# EAGLE schematic usg-core (EAGLE 9.5.1)

## Sheet 1 of 3
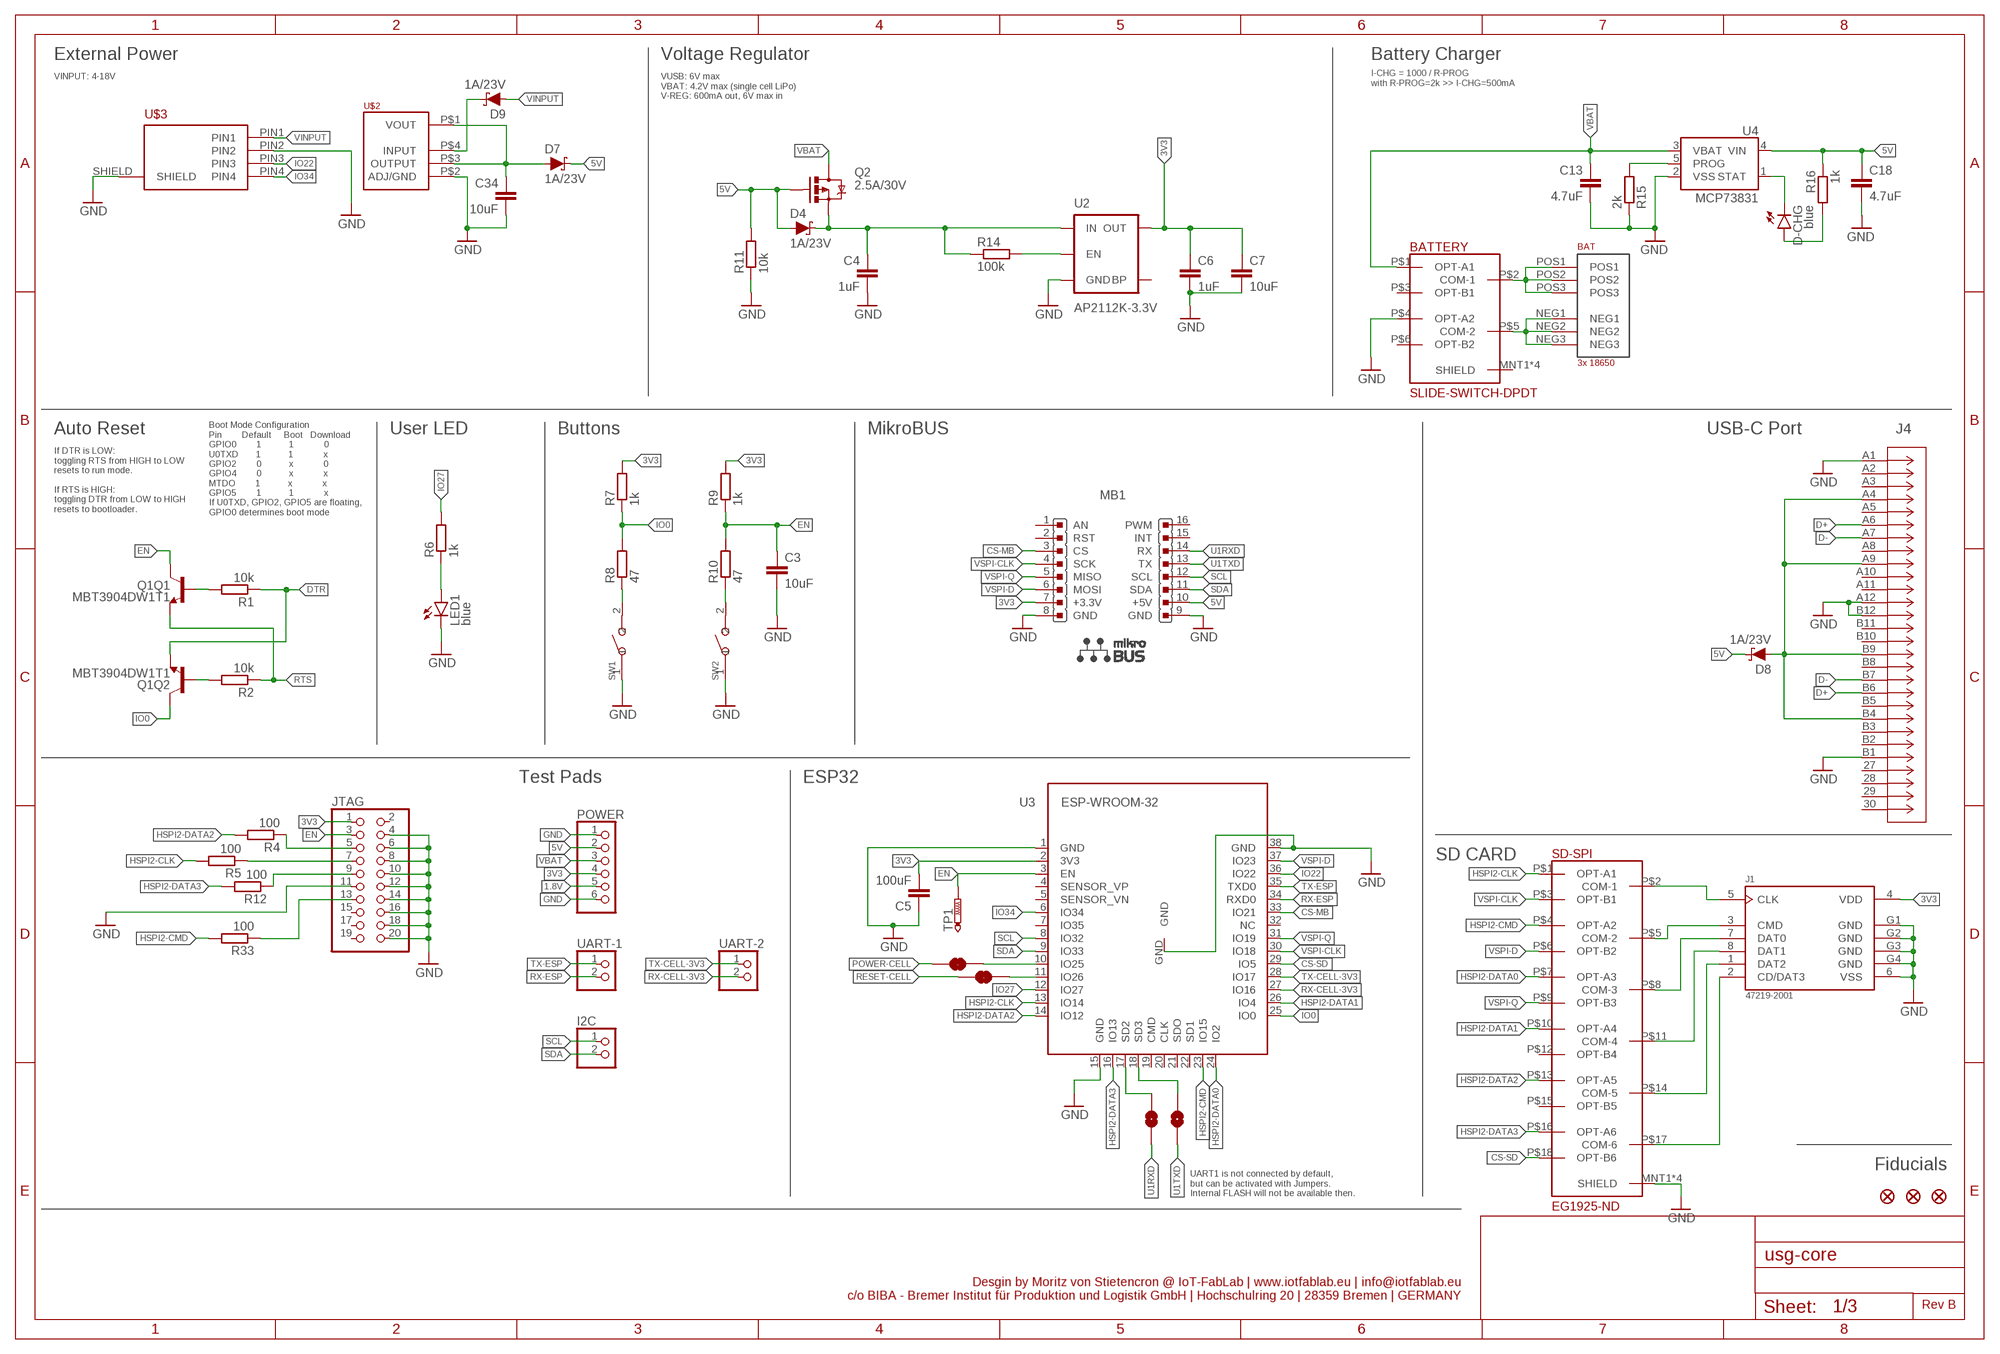
[diagram p0: schematic, sheet 1]

### Parts
BAT  3x 18650  BK-18650-PC6  [BK-18650-PC6]
BATTERY  SLIDE-SWITCH-DPDT  [SLIDE-SWITCH-DPDT]
C3  10uF  C-EUC0603  [C0603]
C4  1uF  C-EUC0603  [C0603]
C5  100uF  C-EUC1206  [C1206]
C6  1uF  C-EUC0603  [C0603]
C7  10uF  C-EUC0603  [C0603]
C13  4.7uF  C-EUC0603  [C0603]
C18  4.7uF  C-EUC0603  [C0603]
C34  10uF  C-EUC0603  [C0603]
D4  1A/23V  DIODE-SCHOTTKY-BAT20J  [SOD-323]
D7  1A/23V  DIODE-SCHOTTKY-BAT20J  [SOD-323]
D8  1A/23V  DIODE-SCHOTTKY-BAT20J  [SOD-323]
D9  1A/23V  DIODE-SCHOTTKY-BAT20J  [SOD-323]
D-CHG  blue  LEDCHIP-LED0603  [CHIP-LED0603]
FD1  FIDUCIAL1X2  [FIDUCIAL-1X2]
FD2  FIDUCIAL1X2  [FIDUCIAL-1X2]
FD3  FIDUCIAL1X2  [FIDUCIAL-1X2]
I2C  PINHD-1X2  [1X02]
J1  47219-2001  [MOLEX_47219-2001]
J4  DX07S024WJ3R400  [CONN_DX07S024WJ3R400]
JP10  JUMPER-SMT_2_NC_TRACE_SILK  [SMT-JUMPER_2_NC_TRACE_SILK]
JP11  JUMPER-SMT_2_NC_TRACE_SILK  [SMT-JUMPER_2_NC_TRACE_SILK]
JTAG  PINHD-2X10  [2X10]
LED1  blue  LEDCHIP-LED0603  [CHIP-LED0603]
MB1  MIKROBUS  [MIKROBUS]
POWER  PINHD-1X6  [1X06]
Q1  MBT3904DW1T1  TRANS_NPN_DUAL-MBT3904DW1T1  [SC70-6]
Q2  2.5A/30V  MOSFET-PCHANNELDMG2307L  [SOT23-3@1]
R1  10k  R-EU_R0603  [R0603]
R2  10k  R-EU_R0603  [R0603]
R4  100  R-EU_R0603  [R0603]
R5  100  R-EU_R0603  [R0603]
R6  1k  R-EU_R0603  [R0603]
R7  1k  R-EU_R0603  [R0603]
R8  47  R-EU_R0603  [R0603]
R9  1k  R-EU_R0603  [R0603]
R10  47  R-EU_R0603  [R0603]
R11  10k  R-EU_R0603  [R0603]
R12  100  R-EU_R0603  [R0603]
R14  100k  R-EU_R0603  [R0603]
R15  2k  R-EU_R0603  [R0603]
R16  1k  R-EU_R0603  [R0603]
R33  100  R-EU_R0603  [R0603]
SD-SPI  EG1925-ND  SLIDE-SWITCH-6PDT  [SLIDE-SWITCH-6PDT]
SJ1  JUMPER-SMT_2_NO_SILK  [SMT-JUMPER_2_NO_SILK]
SJ2  JUMPER-SMT_2_NO_SILK  [SMT-JUMPER_2_NO_SILK]
SW1  SMD-BUTTON(2P-3.0X2.5X1.2+0.4MM)-B3U-1000P-2P-SMD  [SW2-2.6-3.0X2.5X1.2+0.4MM]
SW2  SMD-BUTTON(2P-3.0X2.5X1.2+0.4MM)-B3U-1000P-2P-SMD  [SW2-2.6-3.0X2.5X1.2+0.4MM]
TP1  PTR1B1,27  [B1,27]
U2  AP2112K-3.3V  V_REG_LDOSMD  [SOT23-5]
U3  ESP-WROOM-32  [ESP-WROOM-32]
U4  MCP73831  [SOT23-5]
U$2  LDO-AZ1117I  [SOT223]
U$3  SACC-CI-M12FSD-4CON-L90  [SACC-CI-M12FSD-4CON-L90]
UART-1  PINHD-1X2  [1X02]
UART-2  PINHD-1X2  [1X02]

### Nets
1.8V: POWER.5 ; also sheet 2
3V3 [3.3V]: C5.2 C6.1 C7.1 J1.4(VDD) JTAG.1 MB1.7(+3.3V) POWER.4 R7.2 R9.2 U2.5(OUT) U3.2(3V3) ; also sheet 2,3
5V [3.3V]: C18.1 D4.A D7.C D8.C MB1.10(+5V) POWER.2 Q2.1(G) R11.2 R16.1 U4.4(VIN) ; also sheet 3
BTN1: R10.1 SW2.2
CHG: D-CHG.C U4.1(STAT)
CS-MB: MB1.3(CS) U3.33(IO21)
CS-SD: SD-SPI.P$18(OPT-B6) U3.29(IO5)
D+: J4.A6 J4.B6 ; also sheet 3
D-: J4.A7 J4.B7 ; also sheet 3
DTR: Q1.1(Q2:E) R1.1 ; also sheet 3
EN: C3.1 JTAG.3 Q1.3(Q1:C) R9.1 R10.2 TP1.TP U3.3(EN)
EN1: R14.2 U2.3(EN)
GND [USB_Data]: BATTERY.P$4(OPT-A2) C3.2 C4.2 C5.1 C6.2 C7.2 C13.2 C18.2 C34.2 J1.6(VSS) J1.G1(GND) J1.G2(GND) J1.G3(GND) J1.G4(GND) J4.A1 J4.A12 J4.B1 J4.B12 JTAG.4 JTAG.6 JTAG.8 JTAG.10 JTAG.11 JTAG.12 JTAG.14 JTAG.16 JTAG.18 JTAG.20 LED1.C MB1.8(GND) MB1.9(GND) POWER.1 POWER.6 R11.1 R15.1 SD-SPI.MNT1(SHIELD) SD-SPI.MNT2(SHIELD) SD-SPI.MNT3(SHIELD) SD-SPI.MNT4(SHIELD) SW1.1 SW2.1 U2.2(GND) U3.1(GND) U3.15(GND) U3.38(GND) U3.GND U4.2(VSS) U$2.P$2(ADJ/GND) U$3.PIN2 U$3.SHIELD ; also sheet 2,3
HSPI2-CLK: R5.2 SD-SPI.P$1(OPT-A1) U3.13(IO14)
HSPI2-CMD: R33.2 SD-SPI.P$4(OPT-A2) U3.23(IO15)
HSPI2-DATA0: SD-SPI.P$7(OPT-A3) U3.24(IO2)
HSPI2-DATA1: SD-SPI.P$10(OPT-A4) U3.26(IO4)
HSPI2-DATA2: R4.2 SD-SPI.P$13(OPT-A5) U3.14(IO12)
HSPI2-DATA3: R12.2 SD-SPI.P$16(OPT-A6) U3.16(IO13)
IO0: Q1.6(Q2:C) R7.1 R8.2 U3.25(IO0)
IO22: U3.36(IO22) U$3.PIN3
IO27: R6.2 U3.12(IO27)
IO34: U3.6(IO34) U$3.PIN4
N$1: D9.C U$2.P$4(INPUT)
N$4: D-CHG.A R16.2
N$5: R15.2 U4.5(PROG)
N$6: Q1.5(Q1:B) R1.2
N$7: LED1.A R6.1
N$21: R8.1 SW1.2
N$22: Q1.2(Q2:B) R2.2
N$27: D8.A J4.A4 J4.A9 J4.B4 J4.B9
N$28: JP10.2 U3.10(IO25)
N$29: JP11.2 U3.11(IO26)
N$42: SJ1.2 U3.17(SD2)
N$43: SJ2.2 U3.18(SD3)
N$44: J1.5(CLK) SD-SPI.P$2(COM-1)
N$45: J1.3(CMD) SD-SPI.P$5(COM-2)
N$46: J1.2(CD/DAT3) SD-SPI.P$17(COM-6)
N$47: J1.1(DAT2) SD-SPI.P$14(COM-5)
N$48: J1.8(DAT1) SD-SPI.P$11(COM-4)
N$49: J1.7(DAT0) SD-SPI.P$8(COM-3)
N$51: JTAG.5 R4.1
N$56: JTAG.7 R5.1
N$57: JTAG.9 R12.1
N$58: JTAG.13 R33.1
N$59 [3.3V]: BAT.POS1 BAT.POS2 BAT.POS3 BATTERY.P$2(COM-1)
N$60 [USB_Data]: BAT.NEG1 BAT.NEG2 BAT.NEG3 BATTERY.P$5(COM-2)
POWER-CELL: JP10.1 ; also sheet 2
RESET-CELL: JP11.1 ; also sheet 2
RTS: Q1.4(Q1:E) R2.1 ; also sheet 3
RX-CELL-3V3: U3.27(IO16) UART-2.2 ; also sheet 2
RX-ESP: U3.34(RXD0) UART-1.2 ; also sheet 3
SCL: I2C.1 MB1.12(SCL) U3.8(IO32) ; also sheet 2,3
SDA: I2C.2 MB1.11(SDA) U3.9(IO33) ; also sheet 2,3
TX-CELL-3V3: U3.28(IO17) UART-2.1 ; also sheet 2
TX-ESP: U3.35(TXD0) UART-1.1 ; also sheet 3
U1RXD: MB1.14(RX) SJ1.1
U1TXD: MB1.13(TX) SJ2.1
VBAT [3.3V]: BATTERY.P$1(OPT-A1) C13.1 POWER.3 Q2.3(D) U4.3(VBAT)
VIN [3.3V]: C4.1 D4.C Q2.2(S) R14.1 U2.1(IN)
VINPUT [3.3V]: D9.A U$3.PIN1
VOUT [3.3V]: C34.1 D7.A U$2.P$1(VOUT) U$2.P$3(OUTPUT)
VSPI-CLK: MB1.4(SCK) SD-SPI.P$3(OPT-B1) U3.30(IO18)
VSPI-D: MB1.6(MOSI) SD-SPI.P$6(OPT-B2) U3.37(IO23)
VSPI-Q: MB1.5(MISO) SD-SPI.P$9(OPT-B3) U3.31(IO19)
Unconnected: BATTERY.MNT1(SHIELD) BATTERY.MNT2(SHIELD) BATTERY.MNT3(SHIELD) BATTERY.MNT4(SHIELD) BATTERY.P$3(OPT-B1) BATTERY.P$6(OPT-B2) J4.27 J4.28 J4.29 J4.30 J4.A2 J4.A3 J4.A5 J4.A8 J4.A10 J4.A11 J4.B2 J4.B3 J4.B5 J4.B8 J4.B10 J4.B11 JTAG.2 JTAG.15 JTAG.17 JTAG.19 MB1.1(AN) MB1.2(RST) MB1.15(INT) MB1.16(PWM) SD-SPI.P$12(OPT-B4) SD-SPI.P$15(OPT-B5) U2.4(BP) U3.4(SENSOR_VP) U3.5(SENSOR_VN) U3.7(IO35) U3.19(CMD) U3.20(CLK) U3.21(SDO) U3.22(SD1) U3.32(NC)

### Notes on the sheet
- External Power | Voltage Regulator | Battery Charger
- VINPUT: 4-18V
- VUSB: 6V max
  VBAT: 4.2V max (single cell LiPo)
  V-REG: 600mA out, 6V max in
- I-CHG = 1000 / R-PROG
  with R-PROG=2k >> I-CHG=500mA
- Boot Mode Configuration
  Pin        Default     Boot   Download
  GPIO0        1           1            0
  U0TXD       1           1            x
  GPIO2        0           x            0
  GPIO4        0           x            x
  MTDO        1           x            x
  GPIO5        1           1            x
  If U0TXD, GPIO2, GPIO5 are floating, 
  GPIO0 determines boot mode
- Auto Reset | User LED | Buttons | MikroBUS | USB-C Port
- If DTR is LOW:
  toggling RTS from HIGH to LOW 
  resets to run mode.
  
  If RTS is HIGH:
  toggling DTR from LOW to HIGH
  resets to bootloader.
- Test Pads | ESP32
- SD CARD
- UART1 is not connected by default, 
  but can be activated with Jumpers. 
  Internal FLASH will not be available then.
- Fiducials
- Desgin by Moritz von Stietencron @ IoT-FabLab | www.iotfablab.eu | info@iotfablab.eu
  c/o BIBA - Bremer Institut für Produktion und Logistik GmbH | Hochschulring 20 | 28359 Bremen | GERMANY
- Rev B

## Sheet 2 of 3
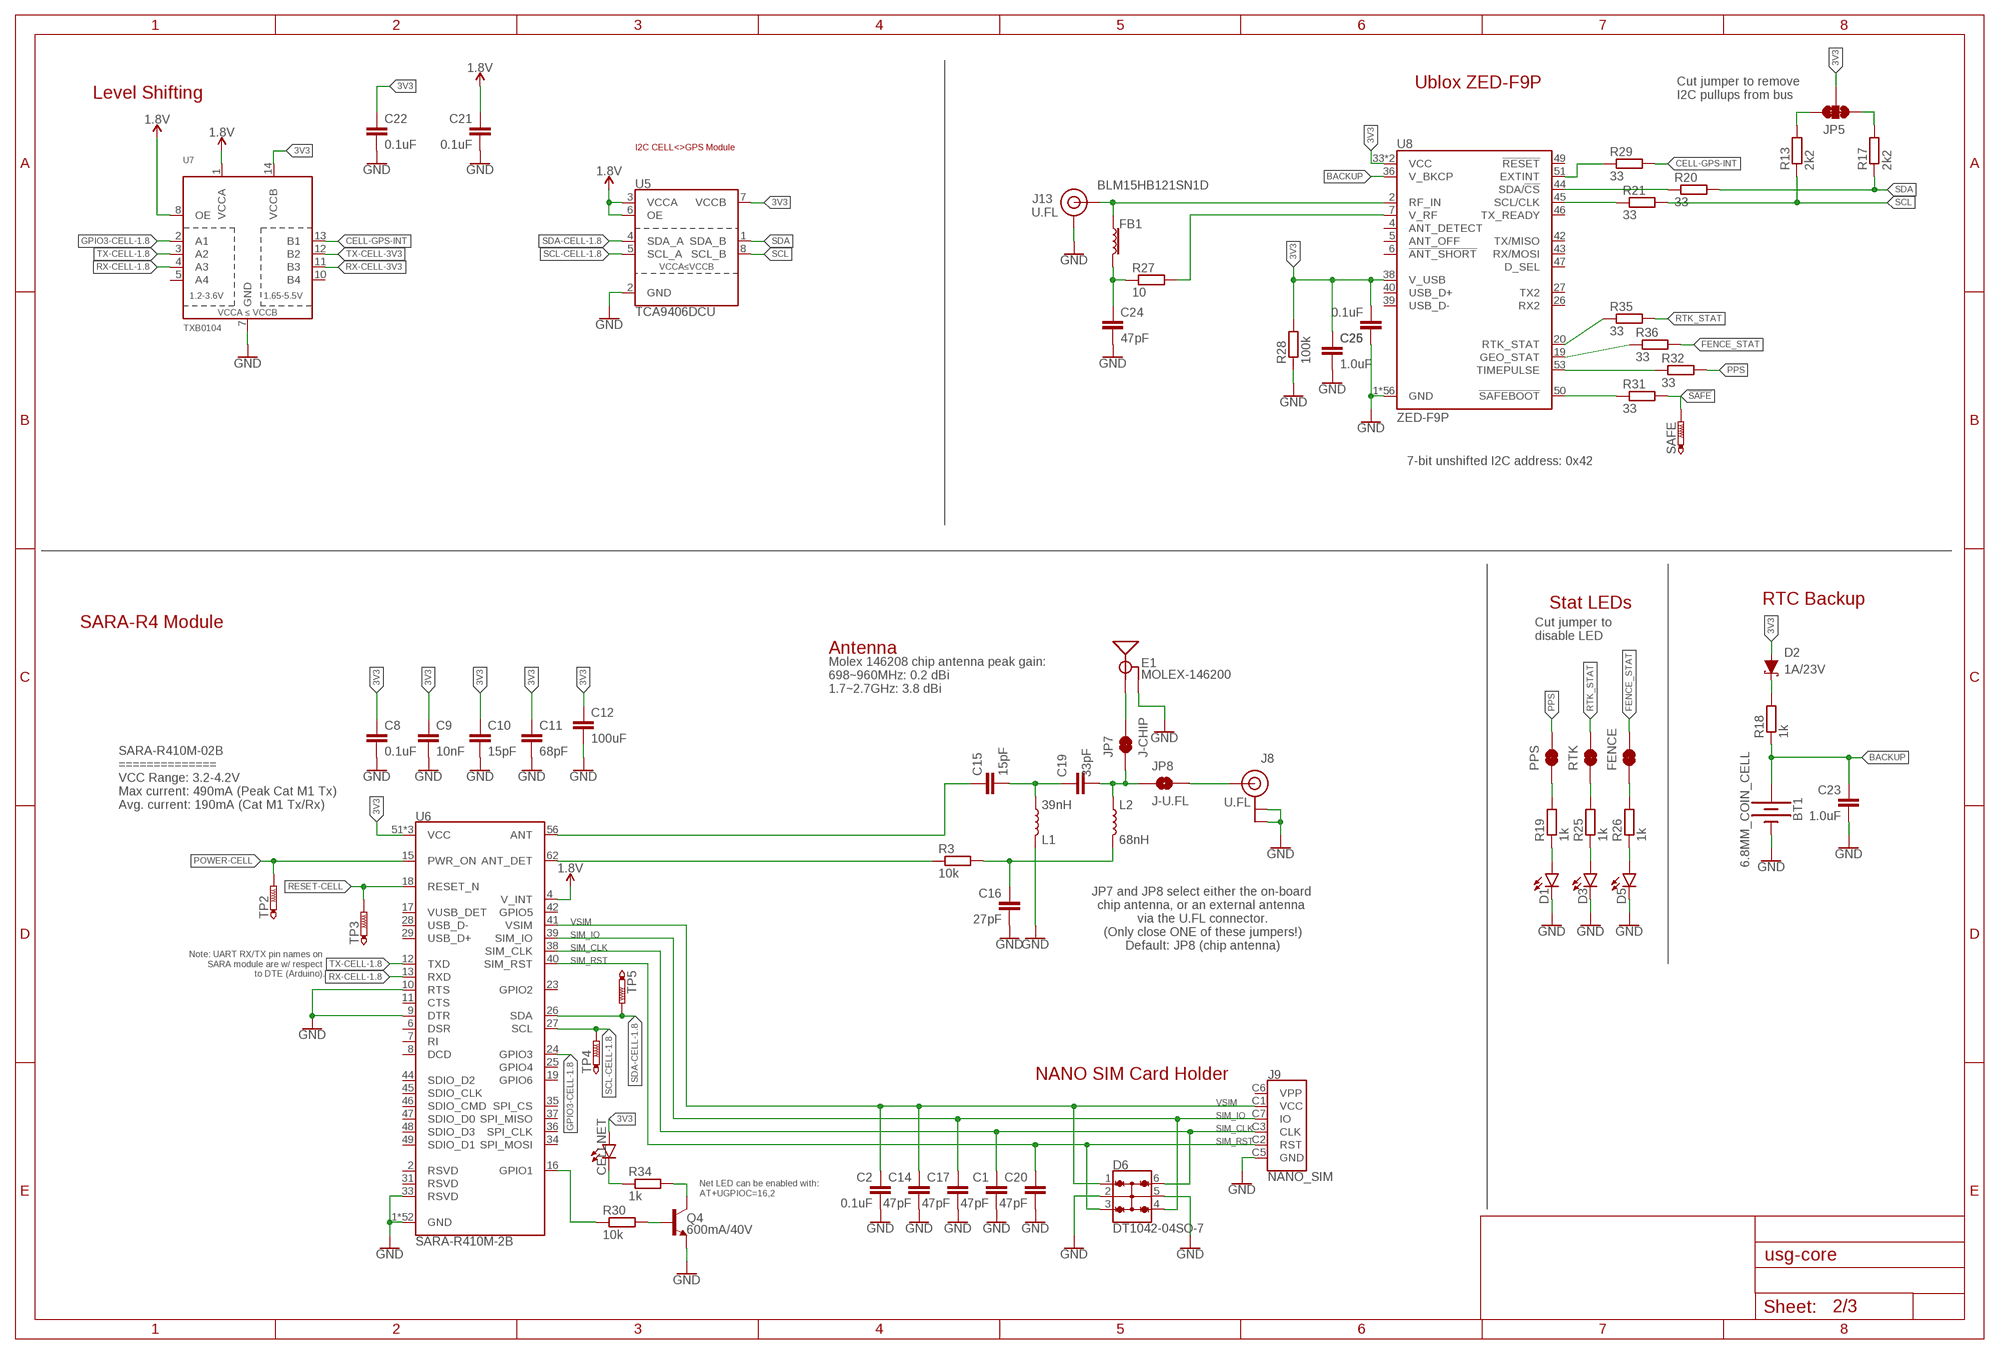
[diagram p1: schematic, sheet 2]

### Parts
BT1  6.8MM_COIN_CELL  BATTERY-6.8MM_SMD  [BATTCON-6.8MM]
C1  47pF  C-EUC0603  [C0603]
C2  0.1uF  C-EUC0603  [C0603]
C8  0.1uF  C-EUC0603  [C0603]
C9  10nF  C-EUC0603  [C0603]
C10  15pF  C-EUC0603  [C0603]
C11  68pF  C-EUC0603  [C0603]
C12  100uF  C-EUC1206  [C1206]
C14  47pF  C-EUC0603  [C0603]
C15  15pF  C-EUC0603  [C0603]
C16  27pF  C-EUC0603  [C0603]
C17  47pF  C-EUC0603  [C0603]
C19  33pF  C-EUC0603  [C0603]
C20  47pF  C-EUC0603  [C0603]
C21  0.1uF  C-EUC0603  [C0603]
C22  0.1uF  C-EUC0603  [C0603]
C23  1.0uF  C-EUC0603  [C0603]
C24  47pF  C-EUC0603  [C0603]
C25  1.0uF  C-EUC0603  [C0603]
C26  0.1uF  C-EUC0603  [C0603]
CELLNET  blue  LEDCHIP-LED0603  [CHIP-LED0603]
D1  blue  LEDCHIP-LED0603  [CHIP-LED0603]
D2  1A/23V  DIODE-SCHOTTKY-BAT20J  [SOD-323]
D3  blue  LEDCHIP-LED0603  [CHIP-LED0603]
D5  blue  LEDCHIP-LED0603  [CHIP-LED0603]
D6  DT1042-04SO-7  TVS_DIODE_ARRAY_4DT1042-04SO-7  [SOT23-6L]
E1  MOLEX-146200  ANTENNA-GROUNDEDMOLEX-146200  [MOLEX_146200]
FB1  FERRITE_BEAD-120_OHM-0402  [0402]
FENCE  JUMPER-SMT_2_NC_TRACE_SILK  [SMT-JUMPER_2_NC_TRACE_SILK]
J8  U.FL  [U.FL]
J9  NANO_SIM  NANO_SIMWURTH  [NANO_SIM_WURTH_693043020611]
J13  U.FL  U.FL2PIN  [U.FL]
JP5  JUMPER-SMT_3_2-NC_TRACE_SILK  [SMT-JUMPER_3_2-NC_TRACE_SILK]
JP7  J-CHIP  JUMPER-SMT_2_NC_TRACE_NO-SILK  [SMT-JUMPER_2_NC_TRACE_NO-SILK]
JP8  J-U.FL  JUMPER-SMT_2_NO_NO-SILK  [SMT-JUMPER_2_NO_NO-SILK]
L1  39nH  INDUCTOR-0603-39NH  [0603]
L2  68nH  INDUCTOR-0603-68NH  [0603]
PPS  JUMPER-SMT_2_NC_TRACE_SILK  [SMT-JUMPER_2_NC_TRACE_SILK]
Q4  600mA/40V  TRANS_NPN-MMBT2222AL  [SOT23-3]
R3  10k  R-EU_R0603  [R0603]
R13  2k2  R-EU_R0603  [R0603]
R17  2k2  R-EU_R0603  [R0603]
R18  1k  R-EU_R0603  [R0603]
R19  1k  R-EU_R0603  [R0603]
R20  33  R-EU_R0603  [R0603]
R21  33  R-EU_R0603  [R0603]
R25  1k  R-EU_R0603  [R0603]
R26  1k  R-EU_R0603  [R0603]
R27  10  R-EU_R0603  [R0603]
R28  100k  R-EU_R0603  [R0603]
R29  33  R-EU_R0603  [R0603]
R30  10k  R-EU_R0603  [R0603]
R31  33  R-EU_R0603  [R0603]
R32  33  R-EU_R0603  [R0603]
R34  1k  R-EU_R0603  [R0603]
R35  33  R-EU_R0603  [R0603]
R36  33  R-EU_R0603  [R0603]
RTK  JUMPER-SMT_2_NC_TRACE_SILK  [SMT-JUMPER_2_NC_TRACE_SILK]
SAFE  PTR1B1,27  [B1,27]
TP2  PTR1B1,27  [B1,27]
TP3  PTR1B1,27  [B1,27]
TP4  PTR1B1,27  [B1,27]
TP5  PTR1B1,27  [B1,27]
U5  TCA9406DCU  [VSSOP-8]
U6  SARA-R410M-2B  SARA-R4  [SARA-LGA]
U7  TXB0104  TXB0104PWR  [TSSOP14]
U8  ZED-F9P  [ZED-F9P]

### Nets
1.8V: C21.1 U5.3(VCCA) U5.6(OE) U6.4(V_INT) U7.1(VCCA) U7.8(OE) ; also sheet 1
3V3 [3.3V]: C8.1 C9.1 C10.1 C11.1 C12.1 C22.1 C25.1 C26.2 CELLNET.A D2.A JP5.2 R28.2 U5.7(VCCB) U6.51(VCC) U6.52(VCC) U6.53(VCC) U7.14(VCCB) U8.33(VCC) U8.34(VCC) U8.38(V_USB) ; also sheet 1,3
!SAFE: R31.2 SAFE.TP
ANT: C15.1 U6.56(ANT)
ANT_DET: R3.1 U6.62(ANT_DET)
ANT_VCC: C24.1 FB1.2 R27.1
BACKUP: BT1.+ C23.1 R18.1 U8.36(V_BKCP)
CELL-GPS-INT: R29.2 U7.13(B1)
FENCE_STAT: FENCE.2 R36.2
GND [USB_Data]: BT1.- C1.2 C2.2 C8.2 C9.2 C10.2 C11.2 C12.2 C14.2 C16.2 C17.2 C20.2 C21.2 C22.2 C23.2 C24.2 C25.2 C26.1 D1.C D3.C D5.C D6.2 D6.5 E1.GND J8.1(GND) J8.2(GND) J9.C5(GND) J13.1(GND) J13.2(GND) L1.1 Q4.2(E) R28.1 U5.2(GND) U6.1(GND) U6.3(GND) U6.5(GND) U6.9(DTR) U6.10(RTS) U6.14(GND) U6.20(GND) U6.21(GND) U6.22(GND) U6.30(GND) U6.32(GND) U6.33(RSVD) U6.43(GND) U6.50(GND) U6.54(GND) U6.55(GND) U6.57(GND) U6.58(GND) U6.59(GND) U6.60(GND) U6.61(GND) U6.63(GND) U6.64(GND) U6.65(GND) U6.66(GND) U6.67(GND) U6.68(GND) U6.69(GND) U6.70(GND) U6.71(GND) U6.72(GND) U6.73(GND) U6.74(GND) U6.75(GND) U6.76(GND) U6.77(GND) U6.78(GND) U6.79(GND) U6.80(GND) U6.81(GND) U6.82(GND) U6.83(GND) U6.84(GND) U6.85(GND) U6.86(GND) U6.87(GND) U6.88(GND) U6.89(GND) U6.90(GND) U6.91(GND) U6.92(GND) U6.93(GND) U6.94(GND) U6.95(GND) U6.96(GND) U7.7(GND) U8.1(GND) U8.3(GND) U8.12(GND) U8.14(GND) U8.32(GND) U8.37(GND) U8.41(GND) U8.48(GND) U8.55(GND) U8.56(GND) U8.57(GND) U8.58(GND) U8.59(GND) U8.60(GND) U8.61(GND) U8.62(GND) U8.63(GND) U8.64(GND) U8.65(GND) U8.66(GND) U8.67(GND) U8.68(GND) U8.69(GND) U8.70(GND) U8.71(GND) U8.72(GND) U8.73(GND) U8.74(GND) U8.75(GND) U8.76(GND) U8.77(GND) U8.78(GND) U8.79(GND) U8.80(GND) U8.81(GND) U8.82(GND) U8.83(GND) U8.84(GND) U8.85(GND) U8.86(GND) U8.87(GND) U8.88(GND) U8.89(GND) U8.90(GND) U8.91(GND) U8.92(GND) U8.93(GND) U8.94(GND) U8.95(GND) U8.96(GND) U8.97(GND) U8.98(GND) U8.99(GND) U8.100(GND) U8.101(GND) U8.102(GND) ; also sheet 1,3
GPIO3-CELL-1.8: U6.24(GPIO3) U7.2(A1)
GPS_ANT1: FB1.1 J13.FEED(SIGNAL) U8.2(RF_IN)
N$2: C16.1 L2.2 R3.2
N$3: C19.2 JP7.1 JP8.1 L2.1
N$8: C15.2 C19.1 L1.2
N$9: J8.FEED(SIGNAL) JP8.2
N$10: E1.FEED(SIGNAL) JP7.2
N$12: JP5.1 R17.2
N$13: JP5.3 R13.2
N$14: D1.A R19.1
N$15: PPS.1 R19.2
N$16: D2.C R18.2
N$20: D3.A R25.1
N$23: R25.2 RTK.1
N$24: D5.A R26.1
N$25: FENCE.1 R26.2
N$26: R27.2 U8.7(V_RF)
N$30: R32.1 U8.53(TIMEPULSE)
N$31: R31.1 U8.50(!SAFEBOOT!)
N$32: R35.1 U8.20(RTK_STAT)
N$33: R36.1 U8.19(GEO_STAT)
N$41: R29.1 U8.51(EXTINT)
N$50: Q4.3(C) R34.2
N$52: Q4.1(B) R30.2
N$53: R30.1 U6.16(GPIO1)
N$55: CELLNET.C R34.1
POWER-CELL: TP2.TP U6.15(PWR_ON) ; also sheet 1
PPS: PPS.2 R32.2
RESET-CELL: TP3.TP U6.18(RESET_N) ; also sheet 1
RTK_STAT: R35.2 RTK.2
RX-CELL-1.8: U6.13(RXD) U7.4(A3)
RX-CELL-3V3: U7.11(B3) ; also sheet 1
SCL: R13.1 R21.2 U5.8(SCL_B) ; also sheet 1,3
SCL-CELL-1.8: TP4.TP U5.5(SCL_A) U6.27(SCL)
SCL_LV: R21.1 U8.45(SCL/CLK)
SDA: R17.1 R20.2 U5.1(SDA_B) ; also sheet 1,3
SDA-CELL-1.8: TP5.TP U5.4(SDA_A) U6.26(SDA)
SDA_LV: R20.1 U8.44(SDA/!CS!)
SIM_CLK: C1.1 D6.6 J9.C3(CLK) U6.38(SIM_CLK)
SIM_IO: C17.1 D6.4 J9.C7(IO) U6.39(SIM_IO)
SIM_RST: C20.1 D6.3 J9.C2(RST) U6.40(SIM_RST)
TX-CELL-1.8: U6.12(TXD) U7.3(A2)
TX-CELL-3V3: U7.12(B2) ; also sheet 1
VSIM: C2.1 C14.1 D6.1 J9.C1(VCC) U6.41(VSIM)
Unconnected: J9.C6(VPP) U6.2(RSVD) U6.6(DSR) U6.7(RI) U6.8(DCD) U6.11(CTS) U6.17(VUSB_DET) U6.19(GPIO6) U6.23(GPIO2) U6.25(GPIO4) U6.28(USB_D-) U6.29(USB_D+) U6.31(RSVD) U6.34(SPI_MOSI) U6.35(SPI_CS) U6.36(SPI_CLK) U6.37(SPI_MISO) U6.42(GPIO5) U6.44(SDIO_D2) U6.45(SDIO_CLK) U6.46(SDIO_CMD) U6.47(SDIO_D0) U6.48(SDIO_D3) U6.49(SDIO_D1) U7.5(A4) U7.10(B4) U8.4(ANT_DETECT) U8.5(ANT_OFF) U8.6(!ANT_SHORT!) U8.26(RX2) U8.27(TX2) U8.39(USB_D-) U8.40(USB_D+) U8.42(TX/MISO) U8.43(RX/MOSI) U8.46(TX_READY) U8.47(D_SEL) U8.49(!RESET!)

### Notes on the sheet
- Ublox ZED-F9P
- Level Shifting
- Cut jumper to remove 
  I2C pullups from bus
- I2C CELL<>GPS Module
- BLM15HB121SN1D
- 7-bit unshifted I2C address: 0x42
- Stat LEDs | RTC Backup
- SARA-R4 Module
- Cut jumper to 
  disable LED
- Antenna
- Molex 146208 chip antenna peak gain: 
  698~960MHz: 0.2 dBi
  1.7~2.7GHz: 3.8 dBi
- SARA-R410M-02B
  ==============
  VCC Range: 3.2-4.2V
  Max current: 490mA (Peak Cat M1 Tx)
  Avg. current: 190mA (Cat M1 Tx/Rx)
- JP7 and JP8 select either the on-board 
  chip antenna, or an external antenna 
  via the U.FL connector.
  (Only close ONE of these jumpers!)
  Default: JP8 (chip antenna)
- Note: UART RX/TX pin names on 
  SARA module are w/ respect 
  to DTE (Arduino).
- NANO SIM Card Holder
- Net LED can be enabled with:
  AT+UGPIOC=16,2

## Sheet 3 of 3
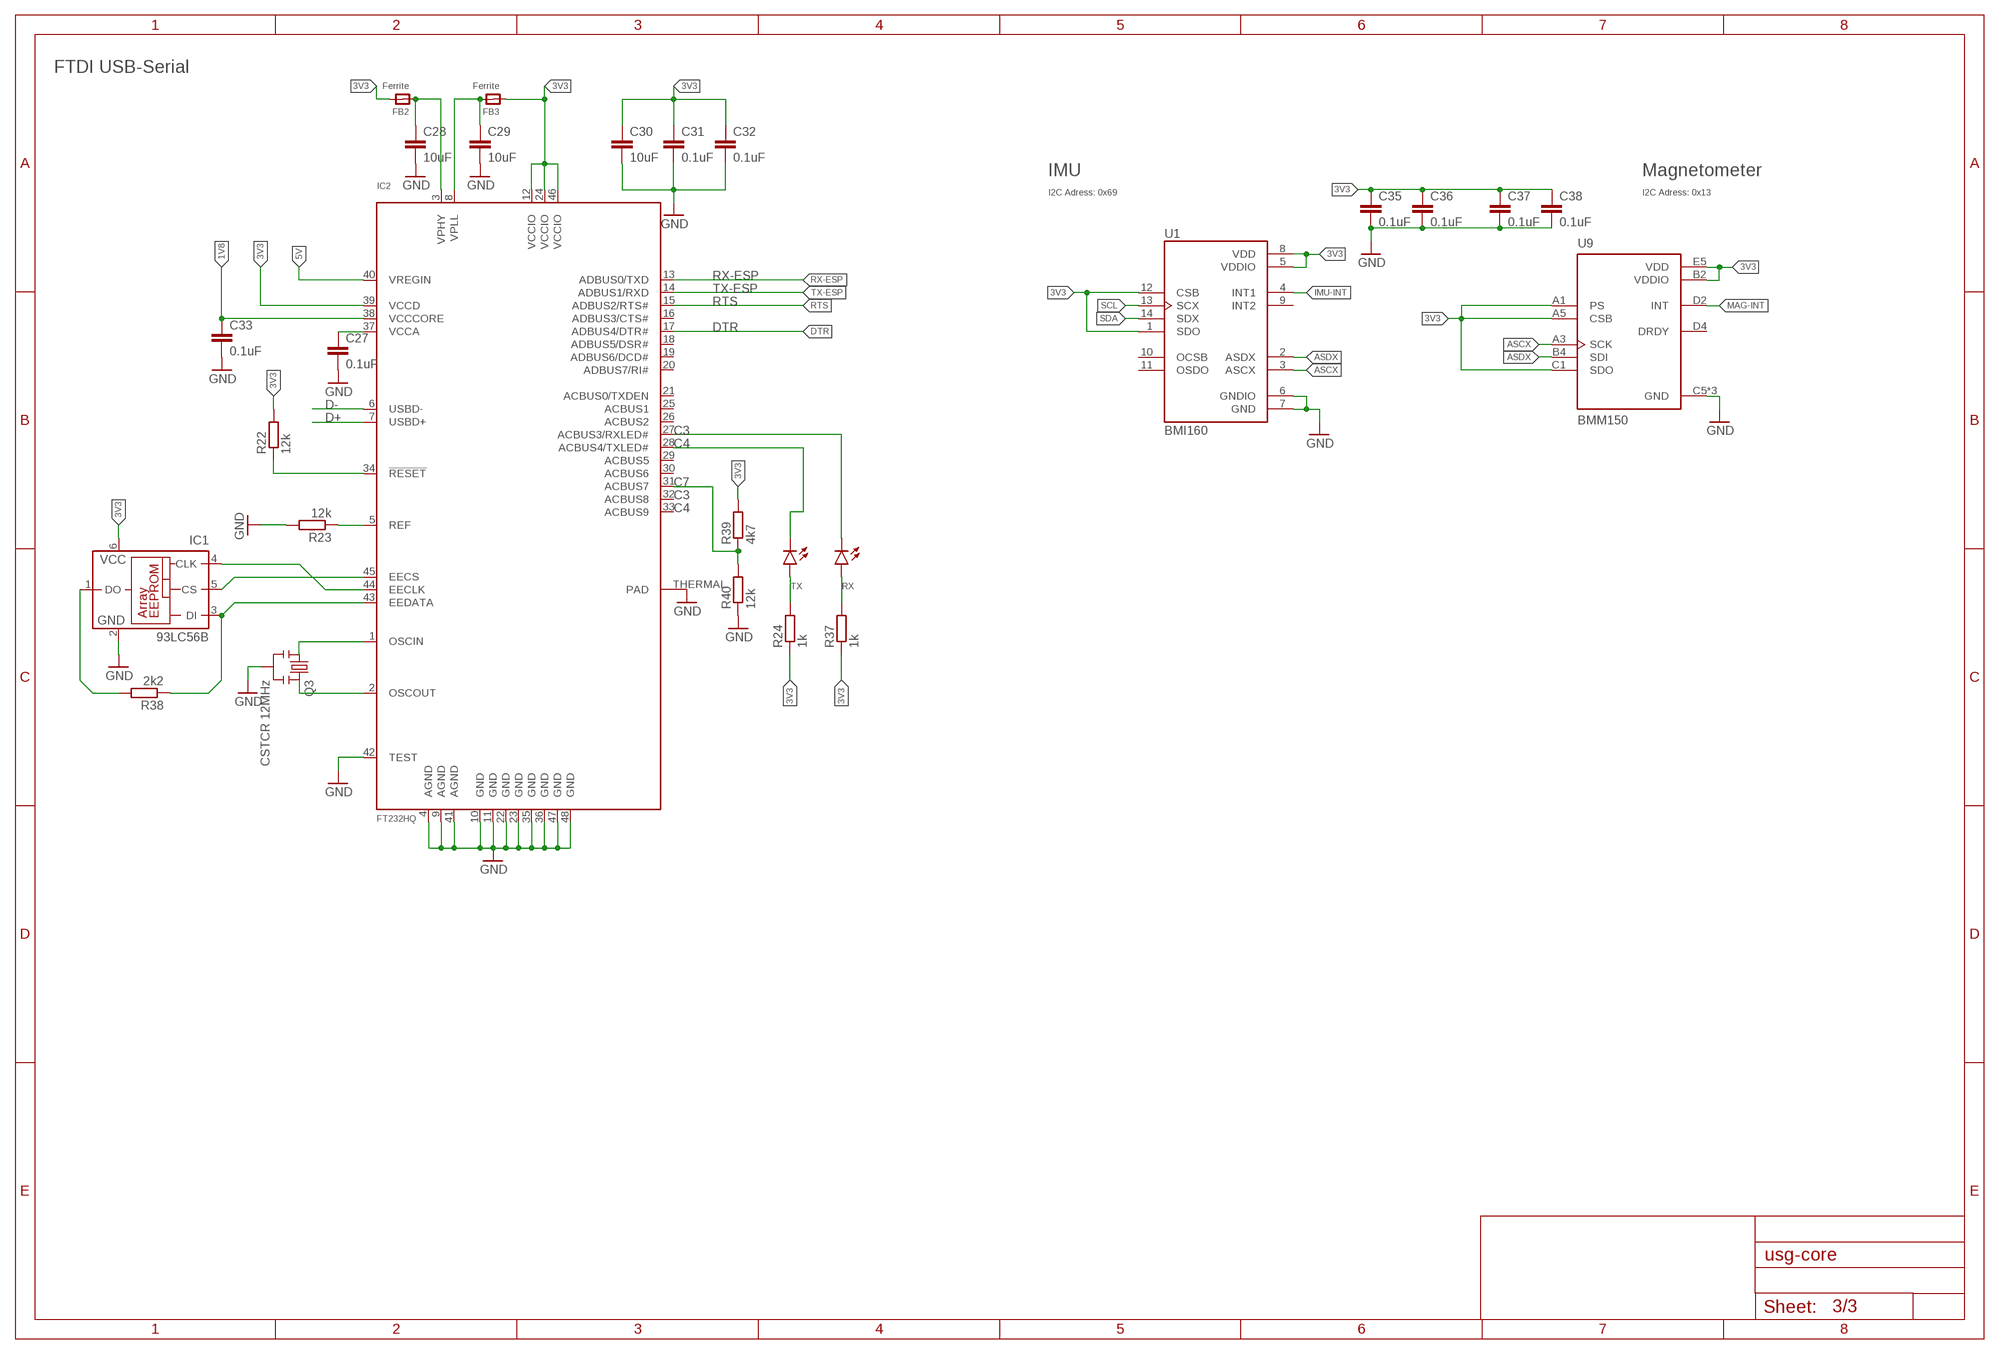
[diagram p2: schematic, sheet 3]

### Parts
C27  0.1uF  C-EUC0603  [C0603]
C28  10uF  C-EUC0603  [C0603]
C29  10uF  C-EUC0603  [C0603]
C30  10uF  C-EUC0603  [C0603]
C31  0.1uF  C-EUC0603  [C0603]
C32  0.1uF  C-EUC0603  [C0603]
C33  0.1uF  C-EUC0603  [C0603]
C35  0.1uF  C-EUC0603  [C0603]
C36  0.1uF  C-EUC0603  [C0603]
C37  0.1uF  C-EUC0603  [C0603]
C38  0.1uF  C-EUC0603  [C0603]
FB2  Ferrite  FERRITE_0805  [_0805]
FB3  Ferrite  FERRITE_0805  [_0805]
IC1  93LC56B  93LC76A  [SOT23-6]
IC2  FT232HQ  [QFN48_8MM]
Q3  CSTCR 12MHz  RESONATORSMD  [RESONATOR-SMD]
R22  12k  R-EU_R0603  [R0603]
R23  12k  R-EU_R0603  [R0603]
R24  1k  R-EU_R0603  [R0603]
R37  1k  R-EU_R0603  [R0603]
R38  2k2  R-EU_R0603  [R0603]
R39  4k7  R-EU_R0603  [R0603]
R40  12k  R-EU_R0603  [R0603]
RX  blue  LEDCHIP-LED0603  [CHIP-LED0603]
TX  blue  LEDCHIP-LED0603  [CHIP-LED0603]
U1  BMI160  [PQFN50P300X250X88-14N]
U9  BMM150  [XDCR_BMM150]

### Nets
1V8: C33.1 IC2.38(VCCCORE)
3V3 [3.3V]: C30.1 C31.1 C32.1 C35.1 C36.1 C37.1 C38.1 FB2.2 FB3.1 IC1.6(VCC) IC2.12(VCCIO) IC2.24(VCCIO) IC2.39(VCCD) IC2.46(VCCIO) R22.2 R24.1 R37.1 R39.2 U1.1(SDO) U1.5(VDDIO) U1.8(VDD) U1.12(CSB) U9.A1(PS) U9.A5(CSB) U9.B2(VDDIO) U9.C1(SDO) U9.E5(VDD) ; also sheet 1,2
5V [3.3V]: IC2.40(VREGIN) ; also sheet 1
ASCX: U1.3(ASCX) U9.A3(SCK)
ASDX: U1.2(ASDX) U9.B4(SDI)
C3: IC2.27(ACBUS3/RXLED#) RX.C
C4: IC2.28(ACBUS4/TXLED#) TX.C
C7: IC2.31(ACBUS7) R39.1 R40.2
D+: IC2.7(USBD+) ; also sheet 1
D-: IC2.6(USBD-) ; also sheet 1
DTR: IC2.17(ADBUS4/DTR#) ; also sheet 1
GND [USB_Data]: C27.2 C28.2 C29.2 C30.2 C31.2 C32.2 C33.2 C35.2 C36.2 C37.2 C38.2 IC1.2(GND) IC2.4(AGND) IC2.9(AGND) IC2.10(GND) IC2.11(GND) IC2.22(GND) IC2.23(GND) IC2.35(GND) IC2.36(GND) IC2.41(AGND) IC2.42(TEST) IC2.47(GND) IC2.48(GND) IC2.THERMAL(PAD) Q3.2 R23.2 R40.1 U1.6(GNDIO) U1.7(GND) U9.C5(GND) U9.E1(GND) U9.E3(GND) ; also sheet 1,2
IMU-INT: U1.4(INT1)
MAG-INT: U9.D2(INT)
N$17: IC2.1(OSCIN) Q3.1
N$18: IC2.2(OSCOUT) Q3.3
N$19: IC2.34(!RESET) R22.1
N$34: IC2.5(REF) R23.1
N$35: R37.2 RX.A
N$36: R24.2 TX.A
N$37: IC1.3(DI) IC2.43(EEDATA) R38.1
N$38: IC1.5(CS) IC2.45(EECS)
N$39: IC1.4(CLK) IC2.44(EECLK)
N$40: IC1.1(DO) R38.2
RTS: IC2.15(ADBUS2/RTS#) ; also sheet 1
RX-ESP: IC2.13(ADBUS0/TXD) ; also sheet 1
SCL: U1.13(SCX) ; also sheet 1,2
SDA: U1.14(SDX) ; also sheet 1,2
TX-ESP: IC2.14(ADBUS1/RXD) ; also sheet 1
VCCA: C27.1 IC2.37(VCCA)
VPHY: C28.1 FB2.1 IC2.3(VPHY)
VPLL: C29.1 FB3.2 IC2.8(VPLL)
Unconnected: IC2.16(ADBUS3/CTS#) IC2.18(ADBUS5/DSR#) IC2.19(ADBUS6/DCD#) IC2.20(ADBUS7/RI#) IC2.21(ACBUS0/TXDEN) IC2.25(ACBUS1) IC2.26(ACBUS2) IC2.29(ACBUS5) IC2.30(ACBUS6) IC2.32(ACBUS8) IC2.33(ACBUS9) U1.9(INT2) U1.10(OCSB) U1.11(OSDO) U9.D4(DRDY)

### Notes on the sheet
- FTDI USB-Serial
- IMU | Magnetometer
- I2C Adress: 0x69 | I2C Adress: 0x13

## Library data of the parts
BAT = iotfablab:BK-18650-PC6
BATTERY = BIBA:SLIDE-SWITCH-DPDT
BT1 = SparkFun-Batteries:BATTERY: Battery - Single Cell A variety of battery chemistries, sizes, and footprints. Device List: 20MM_PTH - Coin Cell Battery Holder - 20mm (PTH) <https://www.sparkfun.com/products/783> 6.8MM_PTH - Coin Cell Battery Holder - 6.8MM(SMD) <https://www.digikey.com/product-detail/en/seiko-instruments/MS621FE-FL11E/728-1057-ND/1889208?WT.srch=1&gclid=CNOQ5a6LzdQCFZS2wAodXCkE0g> 12MM_SMD - Coin Cell Battery Holder - 12mm (SMD) <https://www.sparkfun.com/products/10592> 12MM_PTH - Coin Cell Battery Holder - 12mm (PTH) <https://www.sparkfun.com/products/7948> 20MM_SMD - 20mm Coin Cell Battery Holder (SMD) (2 legs) Used on the Big Time Watch Kit <https://www.sparkfun.com/products/11734> 20MM_SMD_4LEGS - Coin Cell Battery Holder - 20mm (SMD) <https://www.sparkfun.com/products/11892> 20MM_SMD_4LEGS_OVERPASTE - Coin Cell Battery Holder - 20mm (SMD) <https://www.sparkfun.com/products/11892> (Over-paste on the legs) 24.5MM_PTH - Coin Cell Battery Holder - 24.5mm (PTH) <https://www.sparkfun.com/products/8863> 9V - 9V Battery Holder - PC Mount Used on the SparkFun SparkPunk Sound Kit <https://www.sparkfun.com/products/11177> and SparkFun SparkPunk Sequencer Kit <https://www.sparkfun.com/products/12707> 18650 - Battery Holder - 18650 (PTH) <https://www.sparkfun.com/products/13113> AA - Battery Holder - 1xAA (PTH) <https://www.sparkfun.com/products/7949> AAA - Battery Holder - 1xAAA (PTH) <https://www.sparkfun.com/products/12718> AA_KIT - Battery Holder - 1xAA (PTH) <https://www.sparkfun.com/products/7949> Special kit package - pads only have exposed copper on one side of the board. AAA_KIT - Battery Holder - 1xAAA (PTH) <https://www.sparkfun.com/products/12718> Special kit package - pads only have exposed copper on one side of the board.; PROD_ID: BATT-13734
C1-C38 = resistor:C-EU: CAPACITOR, European symbol
CELLNET D1 D3 D5 D-CHG LED1 RX TX = led:LED: LED OSRAM: - CHIPLED LG R971, LG N971, LY N971, LG Q971, LY Q971, LO R971, LY R971 LH N974, LH R974 LS Q976, LO Q976, LY Q976 LO Q996 - Hyper CHIPLED LW Q18S LB Q993, LB Q99A, LB R99A - SideLED LS A670, LO A670, LY A670, LG A670, LP A670 LB A673, LV A673, LT A673, LW A673 LH A674 LY A675 LS A676, LA A676, LO A676, LY A676, LW A676 LS A679, LY A679, LG A679 - Hyper Micro SIDELED® LS Y876, LA Y876, LO Y876, LY Y876 LT Y87S - SmartLED LW L88C, LW L88S LB L89C, LB L89S, LG L890 LS L89K, LO L89K, LY L89K LS L896, LA L896, LO L896, LY L896 - TOPLED LS T670, LO T670, LY T670, LG T670, LP T670 LSG T670, LSP T670, LSY T670, LOP T670, LYG T670 LG T671, LOG T671, LSG T671 LB T673, LV T673, LT T673, LW T673 LH T674 LS T676, LA T676, LO T676, LY T676, LB T676, LH T676, LSB T676, LW T676 LB T67C, LV T67C, LT T67C, LS T67K, LO T67K, LY T67K, LW E67C LS E67B, LA E67B, LO E67B, LY E67B, LB E67C, LV E67C, LT E67C LW T67C LS T679, LY T679, LG T679 LS T770, LO T770, LY T770, LG T770, LP T770 LB T773, LV T773, LT T773, LW T773 LH T774 LS E675, LA E675, LY E675, LS T675 LS T776, LA T776, LO T776, LY T776, LB T776 LHGB T686 LT T68C, LB T68C - Hyper Mini TOPLED® LB M676 - Mini TOPLED Santana® LG M470 LS M47K, LO M47K, LY M47K Source: http://www.osram.convergy.de LUXEON: - LUMILED® LXK2-PW12-R00, LXK2-PW12-S00, LXK2-PW14-U00, LXK2-PW14-V00 LXK2-PM12-R00, LXK2-PM12-S00, LXK2-PM14-U00 LXK2-PE12-Q00, LXK2-PE12-R00, LXK2-PE12-S00, LXK2-PE14-T00, LXK2-PE14-U00 LXK2-PB12-K00, LXK2-PB12-L00, LXK2-PB12-M00, LXK2-PB14-N00, LXK2-PB14-P00, LXK2-PB14-Q00 LXK2-PR12-L00, LXK2-PR12-M00, LXK2-PR14-Q00, LXK2-PR14-R00 LXK2-PD12-Q00, LXK2-PD12-R00, LXK2-PD12-S00 LXK2-PH12-R00, LXK2-PH12-S00 LXK2-PL12-P00, LXK2-PL12-Q00, LXK2-PL12-R00 Source: www.luxeon.com KINGBRIGHT: KA-3528ASYC Source: www.kingbright.com
D2 D4 D7-D9 = SparkFun-DiscreteSemi:DIODE-SCHOTTKY: Schottky diode A Schottky diode is a semiconductor diode which has a low forward voltage drop and a very fast switching action.; PROD_ID: DIO-11623; VALUE: 1A/23V/620mV
D6 = ublox:TVS_DIODE_ARRAY_4; PROD_ID: DIO-14095
E1 = ublox:ANTENNA-GROUNDED: Antenna w/ Ground Connection 2.4GHz antennae with signal and ground terminals. TRACE_ANTENNA_2.4GHZ_15.2MM - Meander Trace antenna 15.2 x 5.7mm footprint Based on layout from TI app note AN043 <http://www.ti.com/lit/an/swra117d/swra117d.pdf>. TRACE_ANTENNA_2.4GHZ_25.7MM - Inverted F trace antenna 25.7 x 7.5 mm footprint. Based on layout from TI design note DN0007 <http://www.ti.com/lit/an/swru120b/swru120b.pdf>.; PROD_ID: ANT-14096
FB1 = SparkFun-Coils:FERRITE_BEAD-120_OHM: Ferrite Bead (blocks, cores, rings, chokes, etc.) Inductor with layers of ferrite used to suppress high frequencies. Often used to isolate high frequency noise.; MFG_PART: BLM15HB121SN1D; PROD_ID: NDUC-14206
FB2 FB3 = microbuilder:FERRITE: Ferrite Bead 0603 MMZ1608B121C - 120 Ohm @ 100MHz, 600mA, 0.15 Ohm DC Resistance - Digikey: 445-2164-1-ND BK1608HW121-T - 120 Ohm, 600mA Ferrite Chip - Digikey: 587-1876-2-ND 0805 HZ0805B272R-10 - 2.7K Ohm @ 100MHz, 200mA, 0.8 Ohm DC Resistance - Digikey: 240-2504-1-ND (see also Murata BLM21BD272SN1L) MMZ2012Y152B - 1.5K Ohm @ 100MHz, 500mA, 0.4 Ohm DC Resistance - Digikey: 445-1560-1-ND - Mainly for high frequency (80-400MHz) MMZ2012R102A - 1K Ohm @ 100MHz, 500mA, 0.3 Ohm DC Resistance - Digikey: 445-1555-2-ND - More general purpose (10-200MHz)
FD1-FD3 = SparkFun-Aesthetics:FIDUCIAL: Fiducial Alignment Points Point-of-reference for pick-and-place machines and other optical instruments.
FENCE JP7 JP10 JP11 PPS RTK = SparkFun-Jumpers:JUMPER-SMT_2_NC_TRACE: Normally closed trace jumper This jumper has a trace between two pads so it's normally closed (NC). Use a razor knife to open the connection. For best results follow the IPC guidelines for cutting traces: Cutout at least 0.063 mm (0.005 in). Remove all loose material to clean up the cut area. Seal the cut with an approved epoxy. Reapply solder to reclose the connection.
I2C UART-1 UART-2 = pinhead:PINHD-1X2: PIN HEADER
IC1 = microchip:93*76?: 8K Microwire Compatible Serial EEPROM Source: http://ww1.microchip.com/downloads/en/DeviceDoc/21796H.pdf; MF: MICROCHIP; MPN: 93LC76AT-I/OT; OC_FARNELL: 1556170; OC_NEWARK: 61H6824
IC2 = microbuilder:FT232H
J1 = 47219-2001:47219-2001: 1.10mm Pitch microSD Card Connector, Hinge Type, Lead-Free http://www.snapeda.com/parts/47219-2001/Molex%20/%20Waldom/view-part/#; AVAILABILITY: Unavailable; DESCRIPTION: Conn Micro SD Card SKT 8 POS 1.1mm Solder RA SMD 0.5A/Contact Embossed T/R; MF: Molex; MP: 47219-2001; PACKAGE: None; PRICE: None
J4 = BIBA:DX07S024WJ3R400; MANUFACTURER_PART_NUMBER: DX07S024WJ3R400; VENDOR: JAE Electronics
J8 = SparkFun-Connectors:U.FL: SMD Antenna Connector - U.FL 2mm height, 3.0mm x 3.0mm receptacle size. SparkFun Products: SparkFun WiFi Shield - ESP8266 <https://www.sparkfun.com/products/13287> SparkFun ESP8266 Thing <https://www.sparkfun.com/products/13231> SparkFun MiniGen - Pro Mini Signal Generator Shield <https://www.sparkfun.com/products/11420>; PROD_ID: CONN-09193; SF_ID: WRL-09144
J9 = ublox:NANO_SIM; PROD_ID: CONN-14097
J13 = SparkFun-Connectors:U.FL2PIN: SMD Antenna Connector - U.FL 2mm height, 3.0mm x 3.0mm receptacle size. SparkFun Products: SparkFun WiFi Shield - ESP8266 <https://www.sparkfun.com/products/13287> SparkFun ESP8266 Thing <https://www.sparkfun.com/products/13231> SparkFun MiniGen - Pro Mini Signal Generator Shield <https://www.sparkfun.com/products/11420>; PROD_ID: CONN-09193; SF_ID: WRL-09144
JP5 = SparkFun-Jumpers:JUMPER-SMT_3_2-NC_TRACE: Normally closed trace jumper (2 of 2 connections) This jumper has a trace between all three pads so they are normally closed (NC). Use a razor knife to open the connection(s). For best results follow the IPC guidelines for cutting traces: Cutout at least 0.063 mm (0.005 in). Remove all loose material to clean up the cut area. Seal the cut with an approved epoxy. Reapply solder to reclose the connection(s).
JP8 SJ1 SJ2 = SparkFun-Jumpers:JUMPER-SMT_2_NO: Normally open jumper This jumper has two pads in close proximity to each other. Apply solder to close the connection. Round pads are easier to solder for beginners, but are a lot larger. SparkFun Product that uses the round pads: SparkFun EL Sequencer <https://www.sparkfun.com/products/12781>
JTAG = pinhead:PINHD-2X10: PIN HEADER
L1 = ublox:INDUCTOR: Inductors Resist changes in electrical current. Basically a coil of wire. SparkFun Products: SparkFun Load Cell Amplifier - HX711 <https://www.sparkfun.com/products/13879> IOIO-OTG - V2.2 <https://www.sparkfun.com/products/13613>; PROD_ID: NDUC-14091
L2 = ublox:INDUCTOR: Inductors Resist changes in electrical current. Basically a coil of wire. SparkFun Products: SparkFun Load Cell Amplifier - HX711 <https://www.sparkfun.com/products/13879> IOIO-OTG - V2.2 <https://www.sparkfun.com/products/13613>
MB1 = MikroBUS:MIKROBUS: MikroBUS Source: MikroBUS specification <http://www.mikroe.com/downloads/get/1737/mikrobus_specification.pdf> MikroBUS <http://www.mikroe.com/mikrobus/>
POWER = pinhead:PINHD-1X6: PIN HEADER
Q1 = SparkFun-DiscreteSemi:TRANS_NPN_DUAL: Dual NPN Transistors in Single Package The MBT3904W1 puts two general purpose 3904 NPN transistors in a single package. Datasheet <http://www.onsemi.com/pub_link/Collateral/MBT3904DW1T1-D.PDF> SparkFun Products: SparkFun ESP32 Thing <https://www.sparkfun.com/products/13907>; PROD_ID: TRANS-13337
Q2 = SparkFun-DiscreteSemi:MOSFET-PCHANNEL: Generic PMOSFET IRLML2244 - TRANS-11153 (SOT-23 -20V -4.3A) (1.Gate 2.Source 3.Drain) FQP27P06 - COM-10349 <http://www.sparkfun.com/products/10349> (TO-220 -60V -27A) (1.Gate 2.Source 3.Drain); PROD_ID: TRANS-11308
Q3 = SparkFun:RESONATOR: Resonator Small SMD resonator. This is the itty bitty 10/20MHz resonators with built in caps. CSTCE10M0G55 and CSTCE20M0V53. Footprint has been reviewed closely but hasn't been tested yet.
Q4 = SparkFun-DiscreteSemi:TRANS_NPN: NPN transistor Current controlled devices typically used to amplify current or used as a switch. BC547 - COM-08928 <http://www.sparkfun.com/products/8928> (TO-92 45V 100mA) (1.Collector 2.Base 3.Emitter) 2N3904 - COM-00521 <http://www.sparkfun.com/products/521> (TO-92 40V 200mA) (1.Emitter 2.Base 3.Collector) P2N2222A - COM-12852 <http://www.sparkfun.com/products/12852> (TO-92 40V 600mA) (1.Collector 2.Base 3.Emitter); PROD_ID: TRANS-08049
R1-R40 = resistor:R-EU_: RESISTOR, European symbol
SAFE TP1-TP5 = testpad:PTR1: TEST PIN
SD-SPI = BIBA:SLIDE-SWITCH-6PDT
SW1 SW2 = OPL_Switch:SMD-BUTTON(2P-3.0X2.5X1.2+0.4MM): 311020047; MPN: B3U-1000P-2P-SMD; VALUE: B3U-1000P-2P-SMD
U1 = BMI160:BMI160: BMI160 2.5 x 3 mm Tiaxial Accelerometer / Gyroscope Inertial Measurement Unit; DESCRIPTION: BMI160 2.5 x 3 mm Tiaxial Accelerometer / Gyroscope Inertial Measurement Unit; DIGI-KEY_PART_NUMBER: 828-1057-1-ND; DIGI-KEY_PURCHASE_URL: https://www.digikey.com/product-detail/en/bosch-sensortec/BMI160/828-1057-1-ND/6136308?utm_source=snapeda&utm_medium=aggregator&utm_campaign=symbol; MF: Bosch; MP: BMI160; PACKAGE: LGA-14 Bosch
U2 = SparkFun-PowerIC:V_REG_LDO: Voltage Regulator LDO Standard 150mA LDO voltage regulator in SOT-23 layout. Micrel part MIC5205. BP (by-pass) pin is used to lower output noise with 470pF cap.; PROD_ID: VREG-12457
U3 = esp32:ESP-WROOM-32
U4 = SparkFun-PowerIC:MCP73831: Miniature single cell, fully integrated Li-Ion, Li-polymer charge management controller http://ww1.microchip.com/downloads/en/DeviceDoc/20001984g.pdf IC-09995; PROD_ID: IC-09995
U5 = ublox:TCA9406; PROD_ID: IC-14098
U6 = ublox:SARA-R4; PROD_ID: IC-14085
U7 = SparkFun-IC-Comms:TXB0104PWR: 4-Bit Bi-Directional Level Shifter 1.2V-3.6V (VCCA) to 1.65V-5.5V (VCCB) bi-directional level shifter with auto direction sensing. Max data rate - VCCA 1.8V: 20Mbps (50ns), VCCA 3.3V: 100Mbps (10ns) Digikey: 296-21929-1-ND (TSSOP) Datasheet <http://cdn.sparkfun.com/datasheets/BreakoutBoards/txb0104.pdf> SparkFun Products SparkFun Cellular Shield - MG2639 <https://www.sparkfun.com/products/13120> (CEL-13120) SparkFun Level Shifting microSD Breakout <https://www.sparkfun.com/products/13743> (DEV-13743) SparkFun Voltage-Level Translator Breakout - TXB0104 <https://www.sparkfun.com/products/11771> (BOB-11771) SparkFun Block for Intel® Edison - UART <https://www.sparkfun.com/products/13040> (DEV-13040) SparkFun Block for Intel® Edison - Arduino <https://www.sparkfun.com/products/13036> (DEV-13036); PROD_ID: IC-13929
U8 = ZED-F9P:ZED-F9P
U9 = BMM150:BMM150: BMM150 Series 3.6 V Surface Mount Three-Axis Geomagnetic Sensor - WLCSP-12; DESCRIPTION: BMM150 Series 3.6 V Surface Mount Three-Axis Geomagnetic Sensor - WLCSP-12; DIGI-KEY_PART_NUMBER: 828-1044-1-ND; DIGI-KEY_PURCHASE_URL: https://www.digikey.com/product-detail/en/bosch-sensortec/BMM150/828-1044-1-ND/4196683?utm_source=snapeda&utm_medium=aggregator&utm_campaign=symbol; MF: Bosch Sensortec; MP: BMM150; PACKAGE: WLCSP-12 Bosch
U$2 = iotfablab:LDO-AZ1117I
U$3 = BIBA:SACC-CI-M12FSD-4CON-L90

## Net classes
1 USB_Data: width 0.127 mm, drill 0.254 mm
2 3.3V: width 0.127 mm